# EAGLE schematic OLED Sheild (EAGLE 6.4)
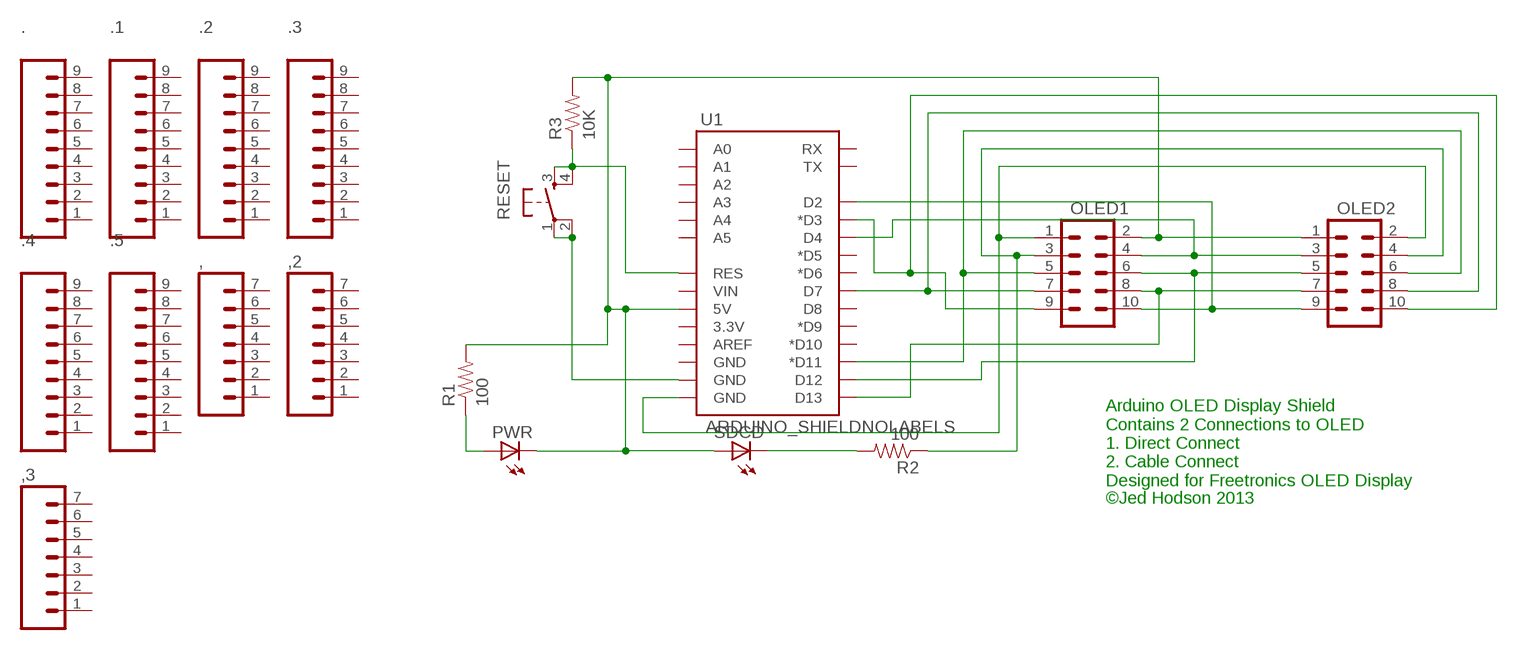
[diagram p0: schematic, sheet 1]

## Parts
,  M07  [1X07]
,2  M07  [1X07]
,3  M07  [1X07]
.  M09  [1X09]
.1  M09  [1X09]
.2  M09  [1X09]
.3  M09  [1X09]
.4  M09  [1X09]
.5  M09  [1X09]
OLED1  M05X2PTH  [AVR_ICSP]
OLED2  M05X2PTH  [AVR_ICSP]
PWR  LED5MM  [LED5MM]
R1  100  RESISTORPTH-1/4W  [AXIAL-0.4]
R2  100  RESISTORPTH-1/4W  [AXIAL-0.4]
R3  10K  RESISTORPTH-1/4W  [AXIAL-0.4]
RESET  TAC_SWITCHPTH  [TACTILE-PTH]
SDCD  LED5MM  [LED5MM]
U1  ARDUINO_SHIELDNOLABELS  [DUEMILANOVE_SHIELD_NOLABELS]

## Nets
N$1: OLED1.2 OLED2.1 PWR.K(C) R1.P$2 R3.P$2 SDCD.A U1.5V
N$2: PWR.A R1.P$1
N$3: OLED1.10 OLED2.9 U1.D2
N$4: OLED1.1 OLED2.2 U1.GND@0(GND)
N$5: OLED1.4 OLED2.3 U1.D4
N$6: R2.P$2 SDCD.K(C)
N$7: OLED1.6 OLED2.5 U1.D12
N$8: OLED1.5 OLED2.6 U1.D11(*D11)
N$9: OLED1.8 OLED2.7 U1.D13
N$10: OLED1.7 OLED2.8 U1.D7
N$11: RESET.1 RESET.2 U1.GND@1(GND)
N$12: R3.P$1 RESET.3 RESET.4 U1.RES
N$17: OLED1.3 OLED2.4 R2.P$1
N$18: OLED1.9 OLED2.10 U1.D3(*D3)
Unconnected: ,2.1 ,2.2 ,2.3 ,2.4 ,2.5 ,2.6 ,2.7 ,3.1 ,3.2 ,3.3 ,3.4 ,3.5 ,3.6 ,3.7 ,.1 ,.2 ,.3 ,.4 ,.5 ,.6 ,.7 .1.1 .1.2 .1.3 .1.4 .1.5 .1.6 .1.7 .1.8 .1.9 .2.1 .2.2 .2.3 .2.4 .2.5 .2.6 .2.7 .2.8 .2.9 .3.1 .3.2 .3.3 .3.4 .3.5 .3.6 .3.7 .3.8 .3.9 .4.1 .4.2 .4.3 .4.4 .4.5 .4.6 .4.7 .4.8 .4.9 .5.1 .5.2 .5.3 .5.4 .5.5 .5.6 .5.7 .5.8 .5.9 ..1 ..2 ..3 ..4 ..5 ..6 ..7 ..8 ..9 U1.3.3V U1.A0 U1.A1 U1.A2 U1.A3 U1.A4 U1.A5 U1.AREF U1.D5(*D5) U1.D6(*D6) U1.D8 U1.D9(*D9) U1.D10(*D10) U1.GND@2(GND) U1.RX U1.TX U1.VIN

## Notes on the sheet
- Arduino OLED Display Shield 
  Contains 2 Connections to OLED
  1. Direct Connect
  2. Cable Connect
  Designed for Freetronics OLED Display
- ©Jed Hodson 2013

## Library data of the parts
, ,2 ,3 = SparkFun-Connectors:M07: Header 7 Standard 7-pin 0.1" header. Use with straight break away headers (SKU : PRT-00116), right angle break away headers (PRT-00553), swiss pins (PRT-00743), machine pins (PRT-00117), and female headers (PRT-00115). NOTES ON THE VARIANTS LOCK and LOCK_LONGPADS... This footprint was designed to help hold the alignment of a through-hole component (i.e. 7-pin header) while soldering it into place. You may notice that each hole has been shifted either up or down by 0.005 of an inch from it's more standard position (which is usually a perfectly straight line). This slight alteration caused the pins (the squares in the middle) to touch the edges of the holes. Because they are alternating, it causes a "brace" to hold the header in place. 0.005 has proven to be the perfect amount of "off-center" position when using our standard breakaway headers. Although looks a little odd when you look at the bare footprint, once you have a header in there, the alteration is very hard to notice. Also, if you push a header all the way into place, it is covered up entirely on the bottom side. This idea of altering the position of holes to aid alignment will be further integrated into the Sparkfun Library for other footprints. It can help hold any component with 3 or more connection pins.
. .1-.5 = SparkFun-Connectors:M09: Header 9 Standard 9-pin 0.1" header. Use with straight break away headers (SKU : PRT-00116), right angle break away headers (PRT-00553), swiss pins (PRT-00743), machine pins (PRT-00117), and female headers (PRT-00115).
OLED1 OLED2 = SparkFun-Connectors:M05X2: Header 5x2 Standard 10-pin dual row 0.1" header. Commonly used with AVR-ISP. Use with Spark Fun Electronics SKU: PRT-00778
PWR SDCD = led:LED: LED OSRAM: - CHIPLED LG R971, LG N971, LY N971, LG Q971, LY Q971, LO R971, LY R971 LH N974, LH R974 LS Q976, LO Q976, LY Q976 LO Q996 - Hyper CHIPLED LW Q18S LB Q993, LB Q99A, LB R99A - SideLED LS A670, LO A670, LY A670, LG A670, LP A670 LB A673, LV A673, LT A673, LW A673 LH A674 LY A675 LS A676, LA A676, LO A676, LY A676, LW A676 LS A679, LY A679, LG A679 - Hyper Micro SIDELED® LS Y876, LA Y876, LO Y876, LY Y876 LT Y87S - SmartLED LW L88C, LW L88S LB L89C, LB L89S, LG L890 LS L89K, LO L89K, LY L89K LS L896, LA L896, LO L896, LY L896 - TOPLED LS T670, LO T670, LY T670, LG T670, LP T670 LSG T670, LSP T670, LSY T670, LOP T670, LYG T670 LG T671, LOG T671, LSG T671 LB T673, LV T673, LT T673, LW T673 LH T674 LS T676, LA T676, LO T676, LY T676, LB T676, LH T676, LSB T676, LW T676 LB T67C, LV T67C, LT T67C, LS T67K, LO T67K, LY T67K, LW E67C LS E67B, LA E67B, LO E67B, LY E67B, LB E67C, LV E67C, LT E67C LW T67C LS T679, LY T679, LG T679 LS T770, LO T770, LY T770, LG T770, LP T770 LB T773, LV T773, LT T773, LW T773 LH T774 LS E675, LA E675, LY E675, LS T675 LS T776, LA T776, LO T776, LY T776, LB T776 LHGB T686 LT T68C, LB T68C - Hyper Mini TOPLED® LB M676 - Mini TOPLED Santana® LG M470 LS M47K, LO M47K, LY M47K Source: http://www.osram.convergy.de LUXEON: - LUMILED® LXK2-PW12-R00, LXK2-PW12-S00, LXK2-PW14-U00, LXK2-PW14-V00 LXK2-PM12-R00, LXK2-PM12-S00, LXK2-PM14-U00 LXK2-PE12-Q00, LXK2-PE12-R00, LXK2-PE12-S00, LXK2-PE14-T00, LXK2-PE14-U00 LXK2-PB12-K00, LXK2-PB12-L00, LXK2-PB12-M00, LXK2-PB14-N00, LXK2-PB14-P00, LXK2-PB14-Q00 LXK2-PR12-L00, LXK2-PR12-M00, LXK2-PR14-Q00, LXK2-PR14-R00 LXK2-PD12-Q00, LXK2-PD12-R00, LXK2-PD12-S00 LXK2-PH12-R00, LXK2-PH12-S00 LXK2-PL12-P00, LXK2-PL12-Q00, LXK2-PL12-R00 Source: www.luxeon.com KINGBRIGHT: KA-3528ASYC Source: www.kingbright.com
R1-R3 = SparkFun-Passives:RESISTOR: Resistor Basic schematic elements and footprints for 0603, 1206, and PTH resistors.
RESET = SparkFun-Electromechanical:TAC_SWITCH: Momentary Switch Button commonly used for reset or general input. Spark Fun Electronics SKU : COM-00097 SMT- SWCH-08247
U1 = SparkFun-Boards:ARDUINO_SHIELD: Arduino shield footprint